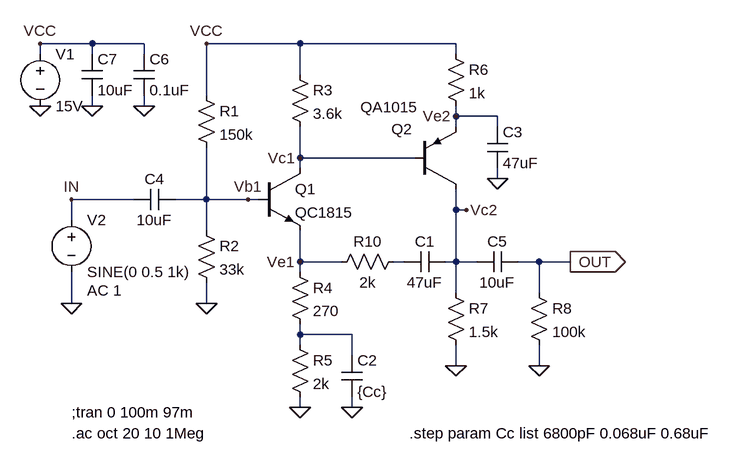
[diagram p0: schematic Negative FeedBack_High_Boost.asc]
Negative FeedBack_High_Boost.asc, the LTspice schematic file:
Version 4
SHEET 1 1124 680
WIRE 0 -64 -80 -64
WIRE 80 -64 0 -64
WIRE 320 -64 176 -64
WIRE 560 -64 320 -64
WIRE -80 -48 -80 -64
WIRE 0 -48 0 -64
WIRE 80 -48 80 -64
WIRE 560 -48 560 -64
WIRE 320 -16 320 -64
WIRE 176 16 176 -64
WIRE 0 32 0 16
WIRE 80 32 80 16
WIRE 560 48 560 32
WIRE 624 48 560 48
WIRE 560 64 560 48
WIRE 624 64 624 48
WIRE 320 112 320 64
WIRE 496 112 320 112
WIRE 320 128 320 112
WIRE 624 144 624 128
WIRE 64 176 -32 176
WIRE 176 176 176 96
WIRE 176 176 128 176
WIRE 240 176 176 176
WIRE 256 176 240 176
WIRE 560 192 560 160
WIRE 576 192 560 192
WIRE -32 208 -32 176
WIRE 176 224 176 176
WIRE 320 272 320 224
WIRE 384 272 320 272
WIRE 480 272 464 272
WIRE 560 272 560 192
WIRE 560 272 544 272
WIRE 592 272 560 272
WIRE 688 272 656 272
WIRE 736 272 688 272
WIRE 320 288 320 272
WIRE 560 320 560 272
WIRE 688 320 688 272
WIRE -32 336 -32 288
WIRE 176 336 176 304
WIRE 320 384 320 368
WIRE 400 384 320 384
WIRE 320 400 320 384
WIRE 400 416 400 384
WIRE 560 432 560 400
WIRE 688 432 688 400
WIRE 320 496 320 480
WIRE 400 496 400 480
FLAG 320 496 0
FLAG 176 336 0
FLAG 560 432 0
FLAG 176 -64 VCC
FLAG -80 -64 VCC
FLAG -80 32 0
FLAG 688 432 0
FLAG 736 272 OUT
IOPIN 736 272 Out
FLAG -32 336 0
FLAG -32 176 IN
FLAG 240 176 Vb1
FLAG 320 272 Ve1
FLAG 320 112 Vc1
FLAG 576 192 Vc2
FLAG 560 48 Ve2
FLAG 0 32 0
FLAG 80 32 0
FLAG 624 144 0
FLAG 400 496 0
SYMBOL res 160 0 R0
SYMATTR InstName R1
SYMATTR Value 150k
SYMBOL res 160 208 R0
SYMATTR InstName R2
SYMATTR Value 33k
SYMBOL res 304 -32 R0
SYMATTR InstName R3
SYMATTR Value 3.6k
SYMBOL res 304 384 R0
SYMATTR InstName R5
SYMATTR Value 2k
SYMBOL cap 544 256 R90
WINDOW 0 0 32 VBottom 2
WINDOW 3 32 32 VTop 2
SYMATTR InstName C1
SYMATTR Value 47uF
SYMBOL res 544 -64 R0
SYMATTR InstName R6
SYMATTR Value 1k
SYMBOL cap 608 64 R0
SYMATTR InstName C3
SYMATTR Value 47uF
SYMBOL res 544 304 R0
SYMATTR InstName R7
SYMATTR Value 1.5k
SYMBOL voltage -80 -64 R0
WINDOW 123 0 0 Left 2
WINDOW 39 0 0 Left 2
SYMATTR InstName V1
SYMATTR Value 15V
SYMBOL cap 128 160 R90
WINDOW 0 0 32 VBottom 2
WINDOW 3 32 32 VTop 2
SYMATTR InstName C4
SYMATTR Value 10uF
SYMBOL cap 656 256 R90
WINDOW 0 0 32 VBottom 2
WINDOW 3 32 32 VTop 2
SYMATTR InstName C5
SYMATTR Value 10uF
SYMBOL res 672 304 R0
SYMATTR InstName R8
SYMATTR Value 100k
SYMBOL voltage -32 192 R0
WINDOW 123 24 124 Left 2
WINDOW 39 0 0 Left 2
SYMATTR Value2 AC 1
SYMATTR InstName V2
SYMATTR Value SINE(0 0.5 1k)
SYMBOL npn 256 128 R0
SYMATTR InstName Q1
SYMATTR Value QC1815
SYMBOL pnp 496 160 M180
WINDOW 0 -35 92 Left 2
WINDOW 3 -83 126 Left 2
SYMATTR InstName Q2
SYMATTR Value QA1015
SYMBOL cap 64 -48 R0
SYMATTR InstName C6
SYMATTR Value 0.1uF
SYMBOL cap -16 -48 R0
SYMATTR InstName C7
SYMATTR Value 10uF
SYMBOL res 480 256 R90
WINDOW 0 0 56 VBottom 2
WINDOW 3 32 56 VTop 2
SYMATTR InstName R10
SYMATTR Value 2k
SYMBOL cap 384 416 R0
SYMATTR InstName C2
SYMATTR Value {Cc}
SYMBOL res 304 272 R0
SYMATTR InstName R4
SYMATTR Value 270
TEXT -32 504 Left 2 !;tran 0 100m 97m
TEXT 488 536 Left 2 !.step param Cc list 6800pF 0.068uF 0.68uF
TEXT -32 536 Left 2 !.ac oct 20 10 1Meg

The netlist it stands for:
* Negative FeedBack_High_Boost.asc
R1 VCC Vb1 150k
R2 Vb1 0 33k
R3 VCC Vc1 3.6k
R5 N002 0 2k
C1 Vc2 N001 47uF
R6 VCC Ve2 1k
C3 Ve2 0 47uF
R7 Vc2 0 1.5k
V1 VCC 0 15V
C4 Vb1 IN 10uF
C5 OUT Vc2 10uF
R8 OUT 0 100k
V2 IN 0 SINE(0 0.5 1k) AC 1
Q1 Vc1 Vb1 Ve1 0 QC1815
Q2 Vc2 Vc1 Ve2 0 QA1015
C6 VCC 0 0.1uF
C7 VCC 0 10uF
R10 N001 Ve1 2k
C2 N002 0 {Cc}
R4 Ve1 N002 270
.model NPN NPN
.model PNP PNP
.lib standard.bjt
;tran 0 100m 97m
.step param Cc list 6800pF 0.068uF 0.68uF
.ac oct 20 10 1Meg
.backanno
.end